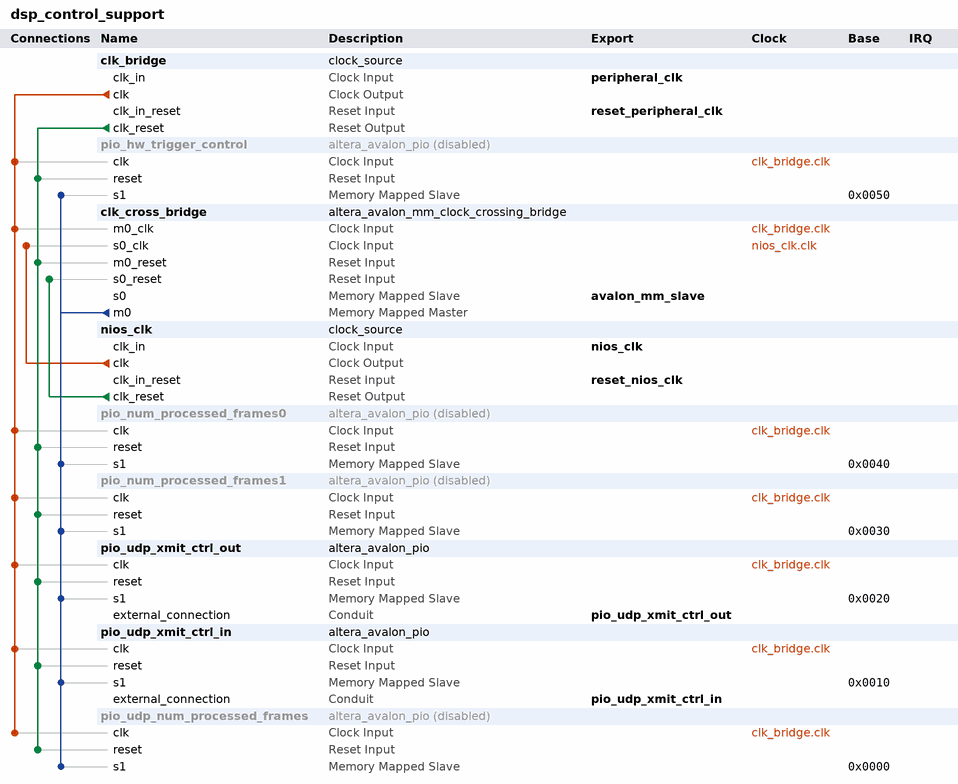
[diagram p0: system contents]
# Platform Designer (Qsys) system dsp_control_support, Stratix IV EP4SGX530KH40C2
# Parameters at their usual value, and those the tool derives, are not listed.
package require -exact qsys 18.1
create_system dsp_control_support
set_project_property DEVICE_FAMILY {Stratix IV}
set_project_property DEVICE EP4SGX530KH40C2

add_instance clk_bridge clock_source 18.1
set_instance_parameter_value clk_bridge clockFrequency 50000000
set_instance_parameter_value clk_bridge resetSynchronousEdges BOTH

add_instance pio_hw_trigger_control altera_avalon_pio 18.1
set_instance_property pio_hw_trigger_control ENABLED false
set_instance_parameter_value pio_hw_trigger_control direction Output
set_instance_parameter_value pio_hw_trigger_control width 8

add_instance clk_cross_bridge altera_avalon_mm_clock_crossing_bridge 18.1
set_instance_parameter_value clk_cross_bridge ADDRESS_WIDTH 10
set_instance_parameter_value clk_cross_bridge COMMAND_FIFO_DEPTH 4
set_instance_parameter_value clk_cross_bridge DATA_WIDTH 32
set_instance_parameter_value clk_cross_bridge MASTER_SYNC_DEPTH 2
set_instance_parameter_value clk_cross_bridge MAX_BURST_SIZE 1
set_instance_parameter_value clk_cross_bridge RESPONSE_FIFO_DEPTH 4
set_instance_parameter_value clk_cross_bridge SLAVE_SYNC_DEPTH 2
set_instance_parameter_value clk_cross_bridge USE_AUTO_ADDRESS_WIDTH 1

add_instance nios_clk clock_source 18.1
set_instance_parameter_value nios_clk clockFrequency 50000000
set_instance_parameter_value nios_clk resetSynchronousEdges BOTH

add_instance pio_num_processed_frames0 altera_avalon_pio 18.1
set_instance_property pio_num_processed_frames0 ENABLED false
set_instance_parameter_value pio_num_processed_frames0 direction Input
set_instance_parameter_value pio_num_processed_frames0 width 32

add_instance pio_num_processed_frames1 altera_avalon_pio 18.1
set_instance_property pio_num_processed_frames1 ENABLED false
set_instance_parameter_value pio_num_processed_frames1 direction Input
set_instance_parameter_value pio_num_processed_frames1 width 32

add_instance pio_udp_xmit_ctrl_out altera_avalon_pio 18.1
set_instance_parameter_value pio_udp_xmit_ctrl_out direction Output
set_instance_parameter_value pio_udp_xmit_ctrl_out width 8

add_instance pio_udp_xmit_ctrl_in altera_avalon_pio 18.1
set_instance_parameter_value pio_udp_xmit_ctrl_in direction Input
set_instance_parameter_value pio_udp_xmit_ctrl_in width 8

add_instance pio_udp_num_processed_frames altera_avalon_pio 18.1
set_instance_property pio_udp_num_processed_frames ENABLED false
set_instance_parameter_value pio_udp_num_processed_frames direction Input
set_instance_parameter_value pio_udp_num_processed_frames width 32

# connections
add_connection clk_bridge.clk clk_cross_bridge.m0_clk clock
add_connection clk_bridge.clk pio_hw_trigger_control.clk clock
add_connection clk_bridge.clk pio_num_processed_frames0.clk clock
add_connection clk_bridge.clk pio_num_processed_frames1.clk clock
add_connection clk_bridge.clk pio_udp_num_processed_frames.clk clock
add_connection clk_bridge.clk pio_udp_xmit_ctrl_in.clk clock
add_connection clk_bridge.clk pio_udp_xmit_ctrl_out.clk clock
add_connection nios_clk.clk clk_cross_bridge.s0_clk clock
add_connection clk_bridge.clk_reset clk_cross_bridge.m0_reset reset
add_connection clk_bridge.clk_reset pio_hw_trigger_control.reset reset
add_connection clk_bridge.clk_reset pio_num_processed_frames0.reset reset
add_connection clk_bridge.clk_reset pio_num_processed_frames1.reset reset
add_connection clk_bridge.clk_reset pio_udp_num_processed_frames.reset reset
add_connection clk_bridge.clk_reset pio_udp_xmit_ctrl_in.reset reset
add_connection clk_bridge.clk_reset pio_udp_xmit_ctrl_out.reset reset
add_connection nios_clk.clk_reset clk_cross_bridge.s0_reset reset
add_connection clk_cross_bridge.m0 pio_hw_trigger_control.s1 avalon
set_connection_parameter_value clk_cross_bridge.m0/pio_hw_trigger_control.s1 baseAddress 0x0050
add_connection clk_cross_bridge.m0 pio_num_processed_frames0.s1 avalon
set_connection_parameter_value clk_cross_bridge.m0/pio_num_processed_frames0.s1 baseAddress 0x0040
add_connection clk_cross_bridge.m0 pio_num_processed_frames1.s1 avalon
set_connection_parameter_value clk_cross_bridge.m0/pio_num_processed_frames1.s1 baseAddress 0x0030
add_connection clk_cross_bridge.m0 pio_udp_num_processed_frames.s1 avalon
set_connection_parameter_value clk_cross_bridge.m0/pio_udp_num_processed_frames.s1 baseAddress 0x0000
add_connection clk_cross_bridge.m0 pio_udp_xmit_ctrl_in.s1 avalon
set_connection_parameter_value clk_cross_bridge.m0/pio_udp_xmit_ctrl_in.s1 baseAddress 0x0010
add_connection clk_cross_bridge.m0 pio_udp_xmit_ctrl_out.s1 avalon
set_connection_parameter_value clk_cross_bridge.m0/pio_udp_xmit_ctrl_out.s1 baseAddress 0x0020

# exported interfaces
add_interface avalon_mm_slave avalon slave
set_interface_property avalon_mm_slave EXPORT_OF clk_cross_bridge.s0
add_interface nios_clk clock sink
set_interface_property nios_clk EXPORT_OF nios_clk.clk_in
add_interface peripheral_clk clock sink
set_interface_property peripheral_clk EXPORT_OF clk_bridge.clk_in
add_interface pio_udp_xmit_ctrl_in conduit end
set_interface_property pio_udp_xmit_ctrl_in EXPORT_OF pio_udp_xmit_ctrl_in.external_connection
add_interface pio_udp_xmit_ctrl_out conduit end
set_interface_property pio_udp_xmit_ctrl_out EXPORT_OF pio_udp_xmit_ctrl_out.external_connection
add_interface reset_nios_clk reset sink
set_interface_property reset_nios_clk EXPORT_OF nios_clk.clk_in_reset
add_interface reset_peripheral_clk reset sink
set_interface_property reset_peripheral_clk EXPORT_OF clk_bridge.clk_in_reset

set_interconnect_requirement {$system} qsys_mm.clockCrossingAdapter AUTO
set_interconnect_requirement {$system} qsys_mm.maxAdditionalLatency 1

save_system dsp_control_support.qsys
